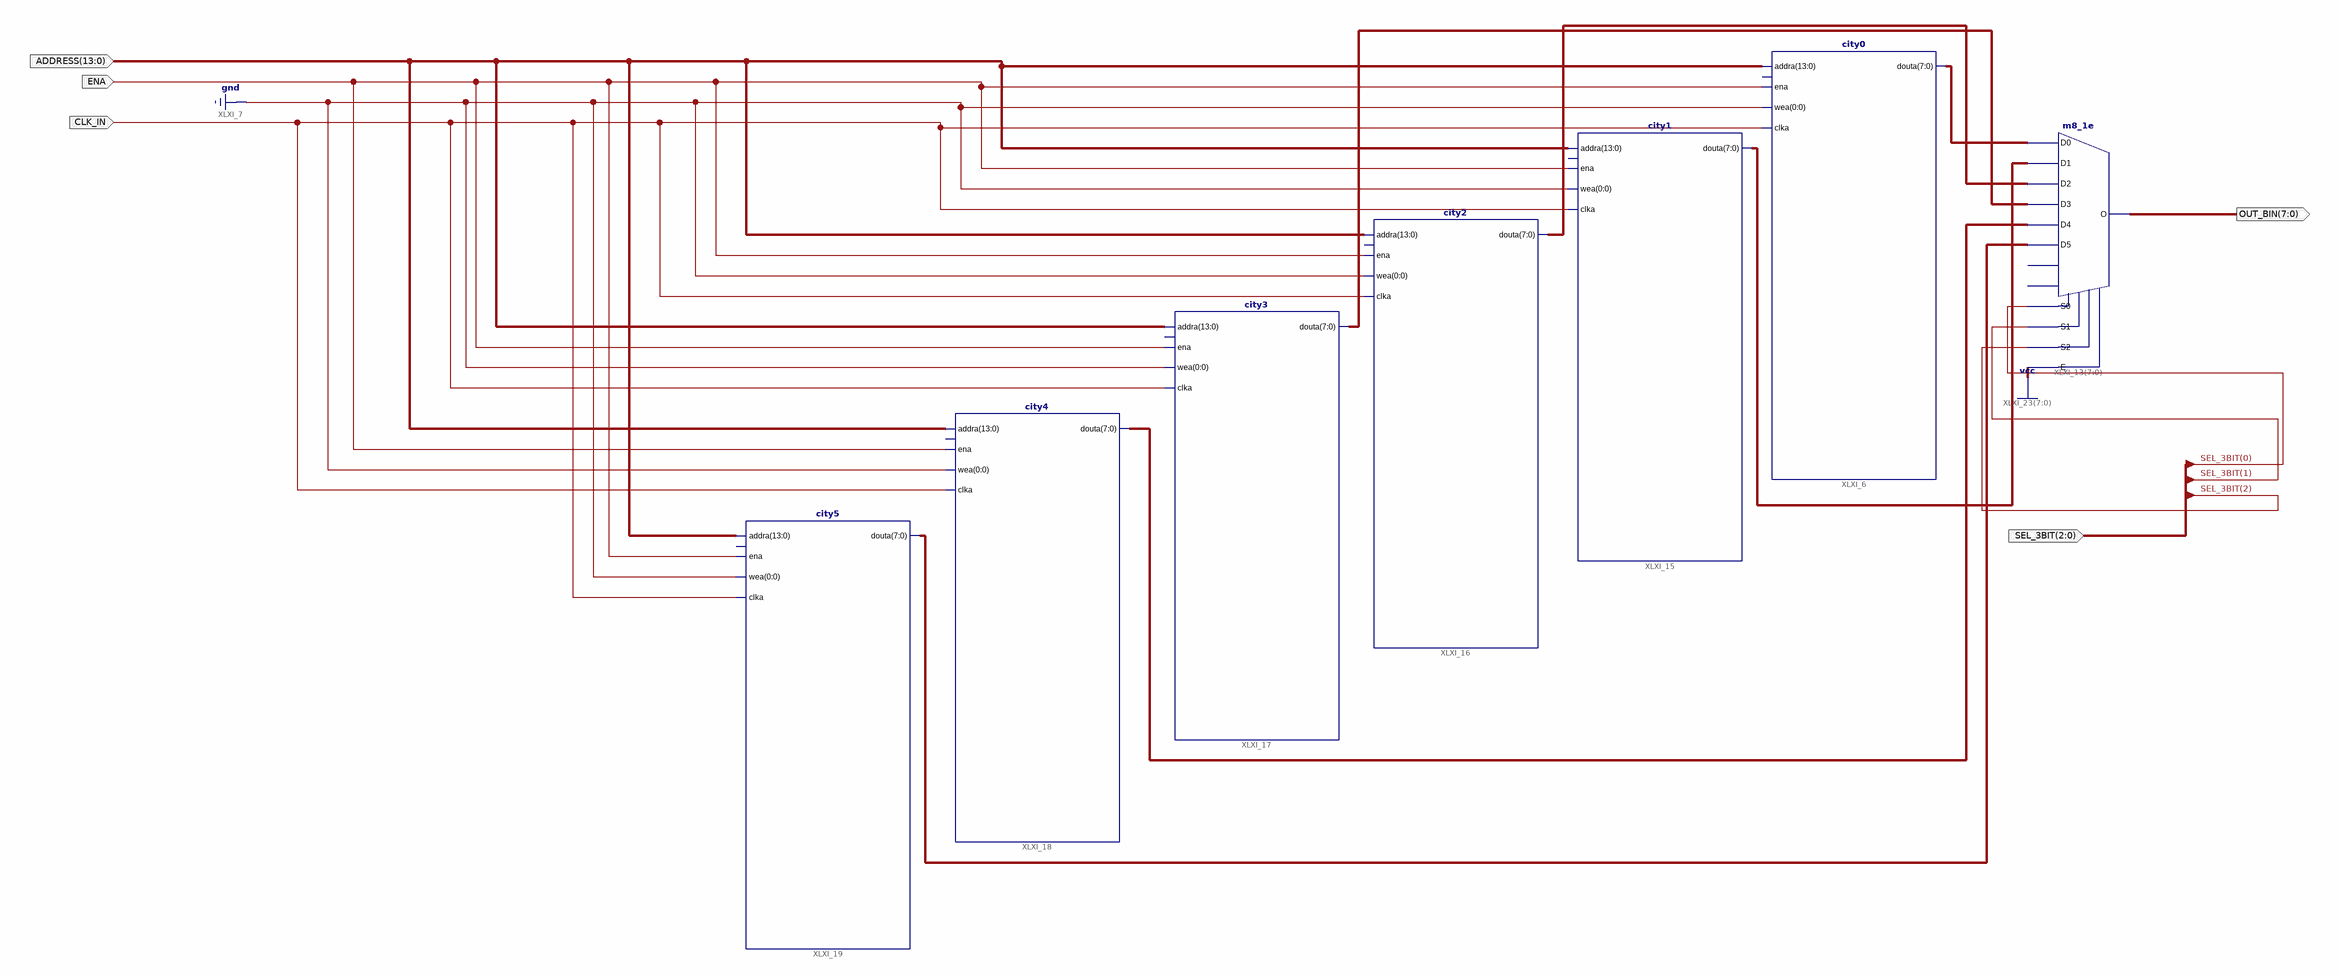
[diagram p0: schematic sheet 1]
// Xilinx ISE schematic Image.sch (spartan6) as structural Verilog: 7 symbols, 5 ports
module Image (
  input  ENA,
  input  [13:0] ADDRESS,
  input  CLK_IN,
  input  [2:0] SEL_3BIT,
  output [7:0] OUT_BIN
);

  wire [7:0] XLXN_17, XLXN_97, XLXN_101, XLXN_105, XLXN_106, XLXN_107;

  city0 XLXI_6 (.addra(ADDRESS), .ena(ENA), .wea(1'b0), .clka(CLK_IN), .douta(XLXN_17));  // open: dina
  m8_1e XLXI_13[7:0] (
    .D0(XLXN_17), .D1(XLXN_101), .D2(XLXN_105), .D3(XLXN_106), .D4(XLXN_107), .D5(XLXN_97), .E({8{1'b1}}),
    .S0(SEL_3BIT[0]), .S1(SEL_3BIT[1]), .S2(SEL_3BIT[2]), .O(OUT_BIN));  // open: D6, D7
  city1 XLXI_15 (.addra(ADDRESS), .ena(ENA), .wea(1'b0), .clka(CLK_IN), .douta(XLXN_101));  // open: dina
  city2 XLXI_16 (.addra(ADDRESS), .ena(ENA), .wea(1'b0), .clka(CLK_IN), .douta(XLXN_105));  // open: dina
  city3 XLXI_17 (.addra(ADDRESS), .ena(ENA), .wea(1'b0), .clka(CLK_IN), .douta(XLXN_106));  // open: dina
  city4 XLXI_18 (.addra(ADDRESS), .ena(ENA), .wea(1'b0), .clka(CLK_IN), .douta(XLXN_107));  // open: dina
  city5 XLXI_19 (.addra(ADDRESS), .ena(ENA), .wea(1'b0), .clka(CLK_IN), .douta(XLXN_97));  // open: dina
endmodule
